# EAGLE schematic FPGA_ADC_USB_Board (EAGLE 6.5.0)
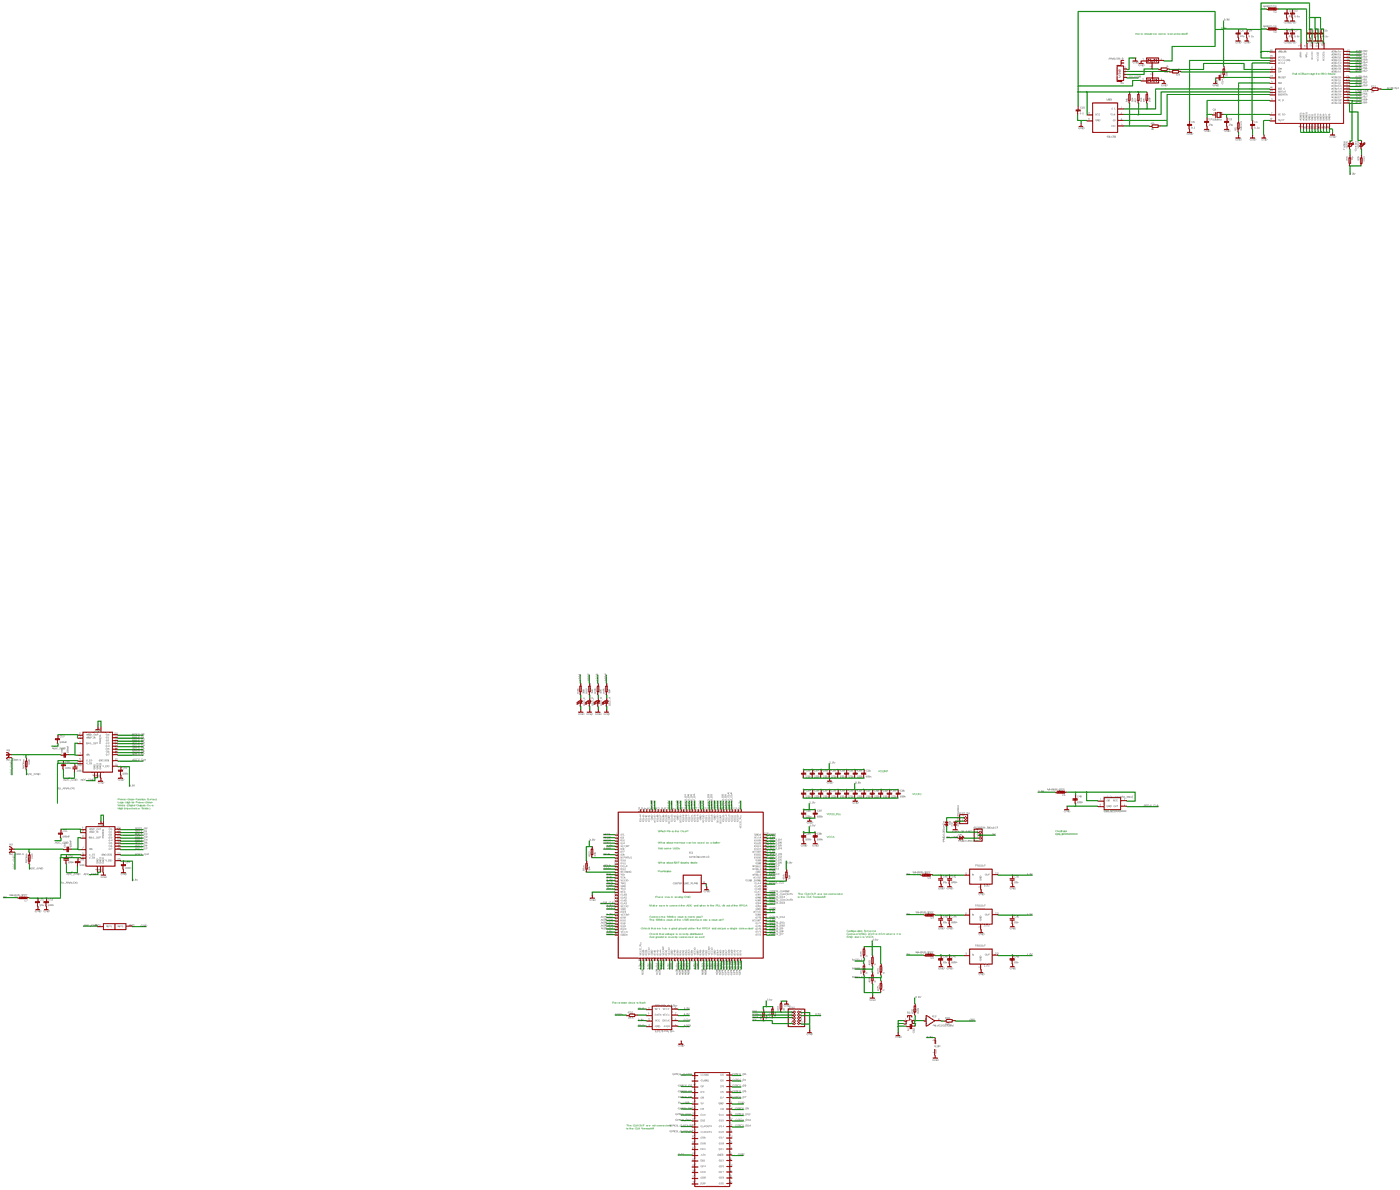
[diagram p0: schematic, sheet 1, overview]
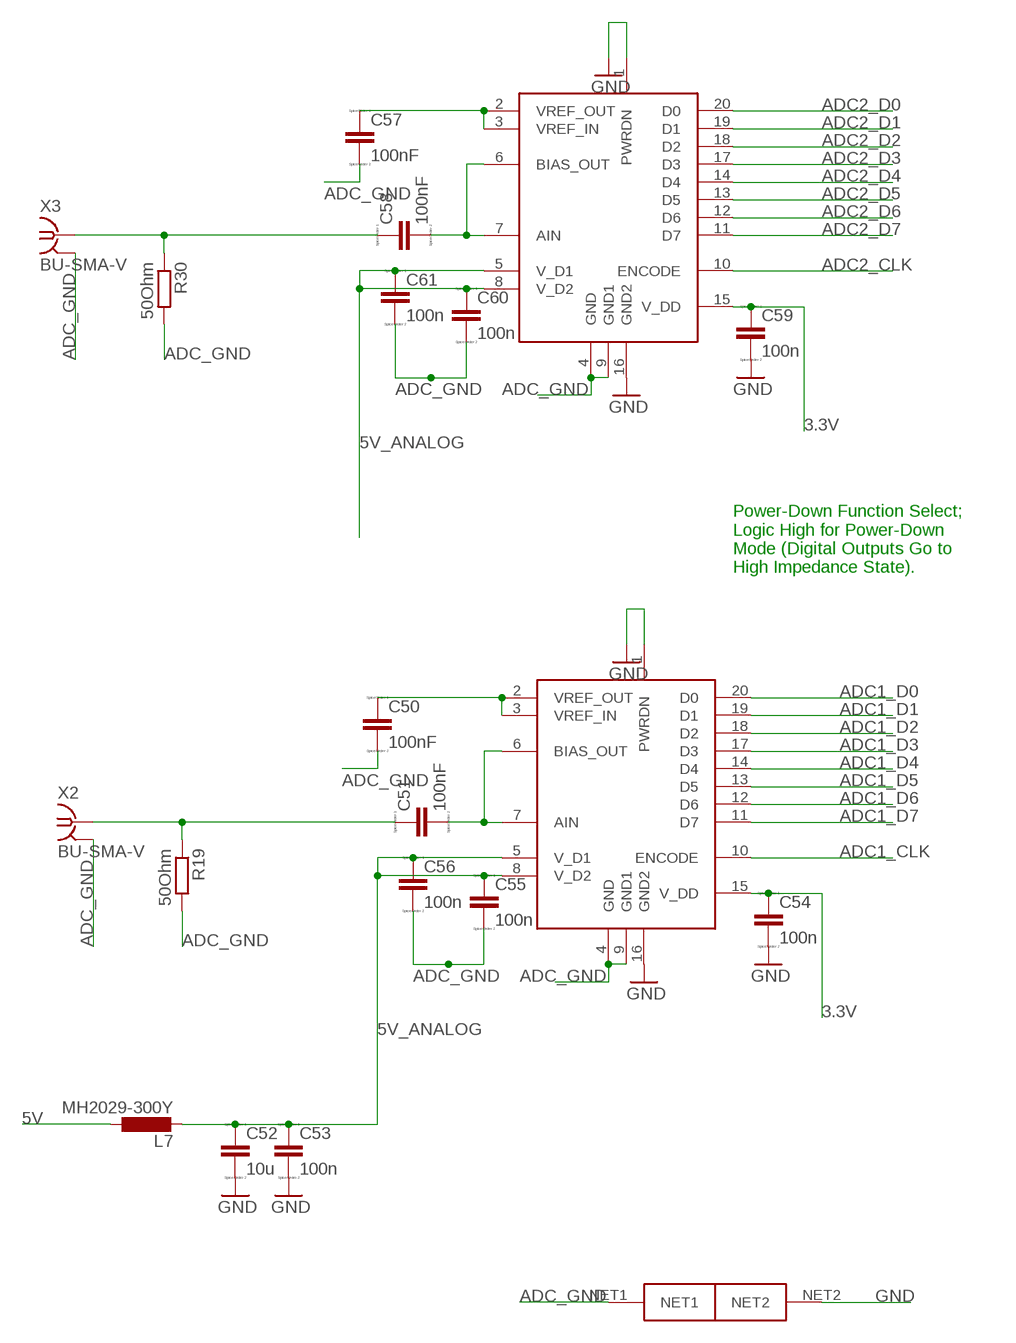
[diagram p1: schematic, sheet 1, part 1 of 4]
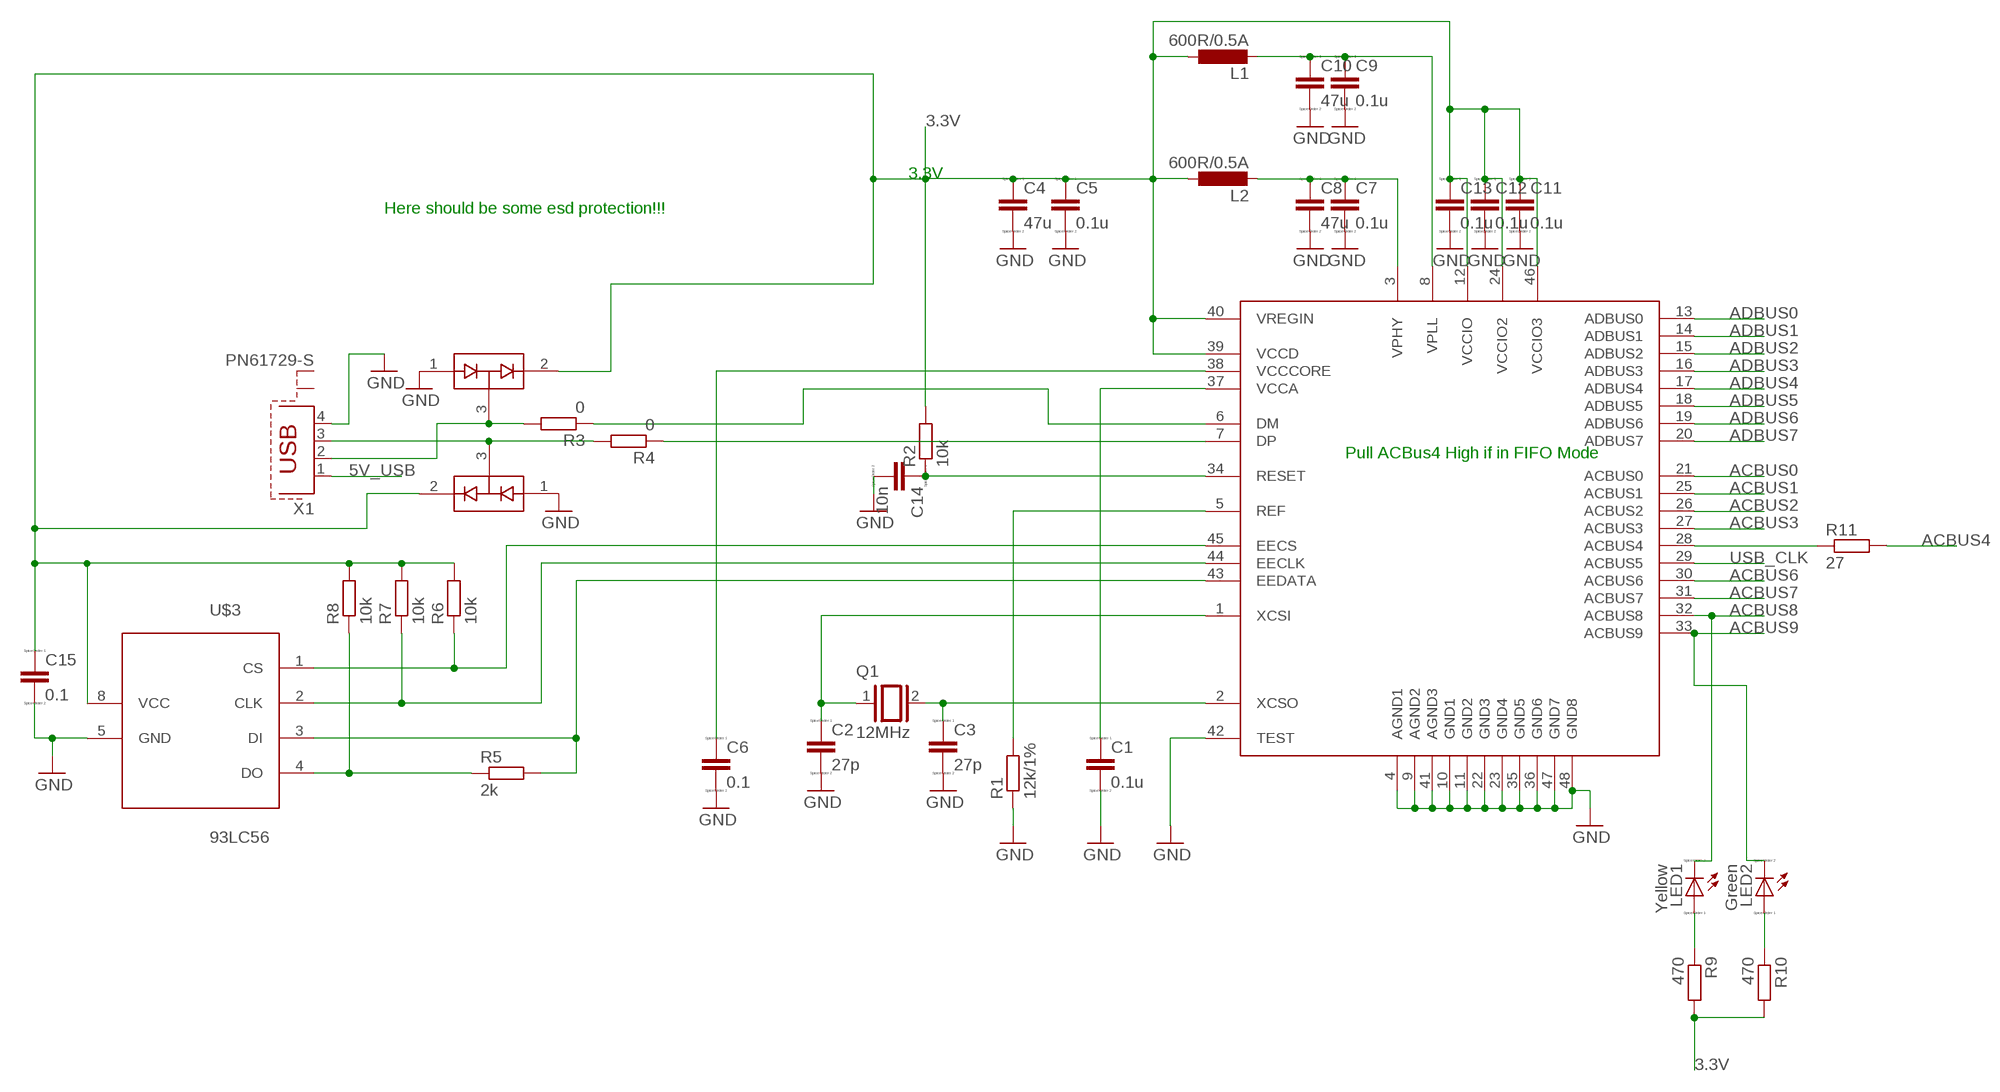
[diagram p2: schematic, sheet 1, part 2 of 4]
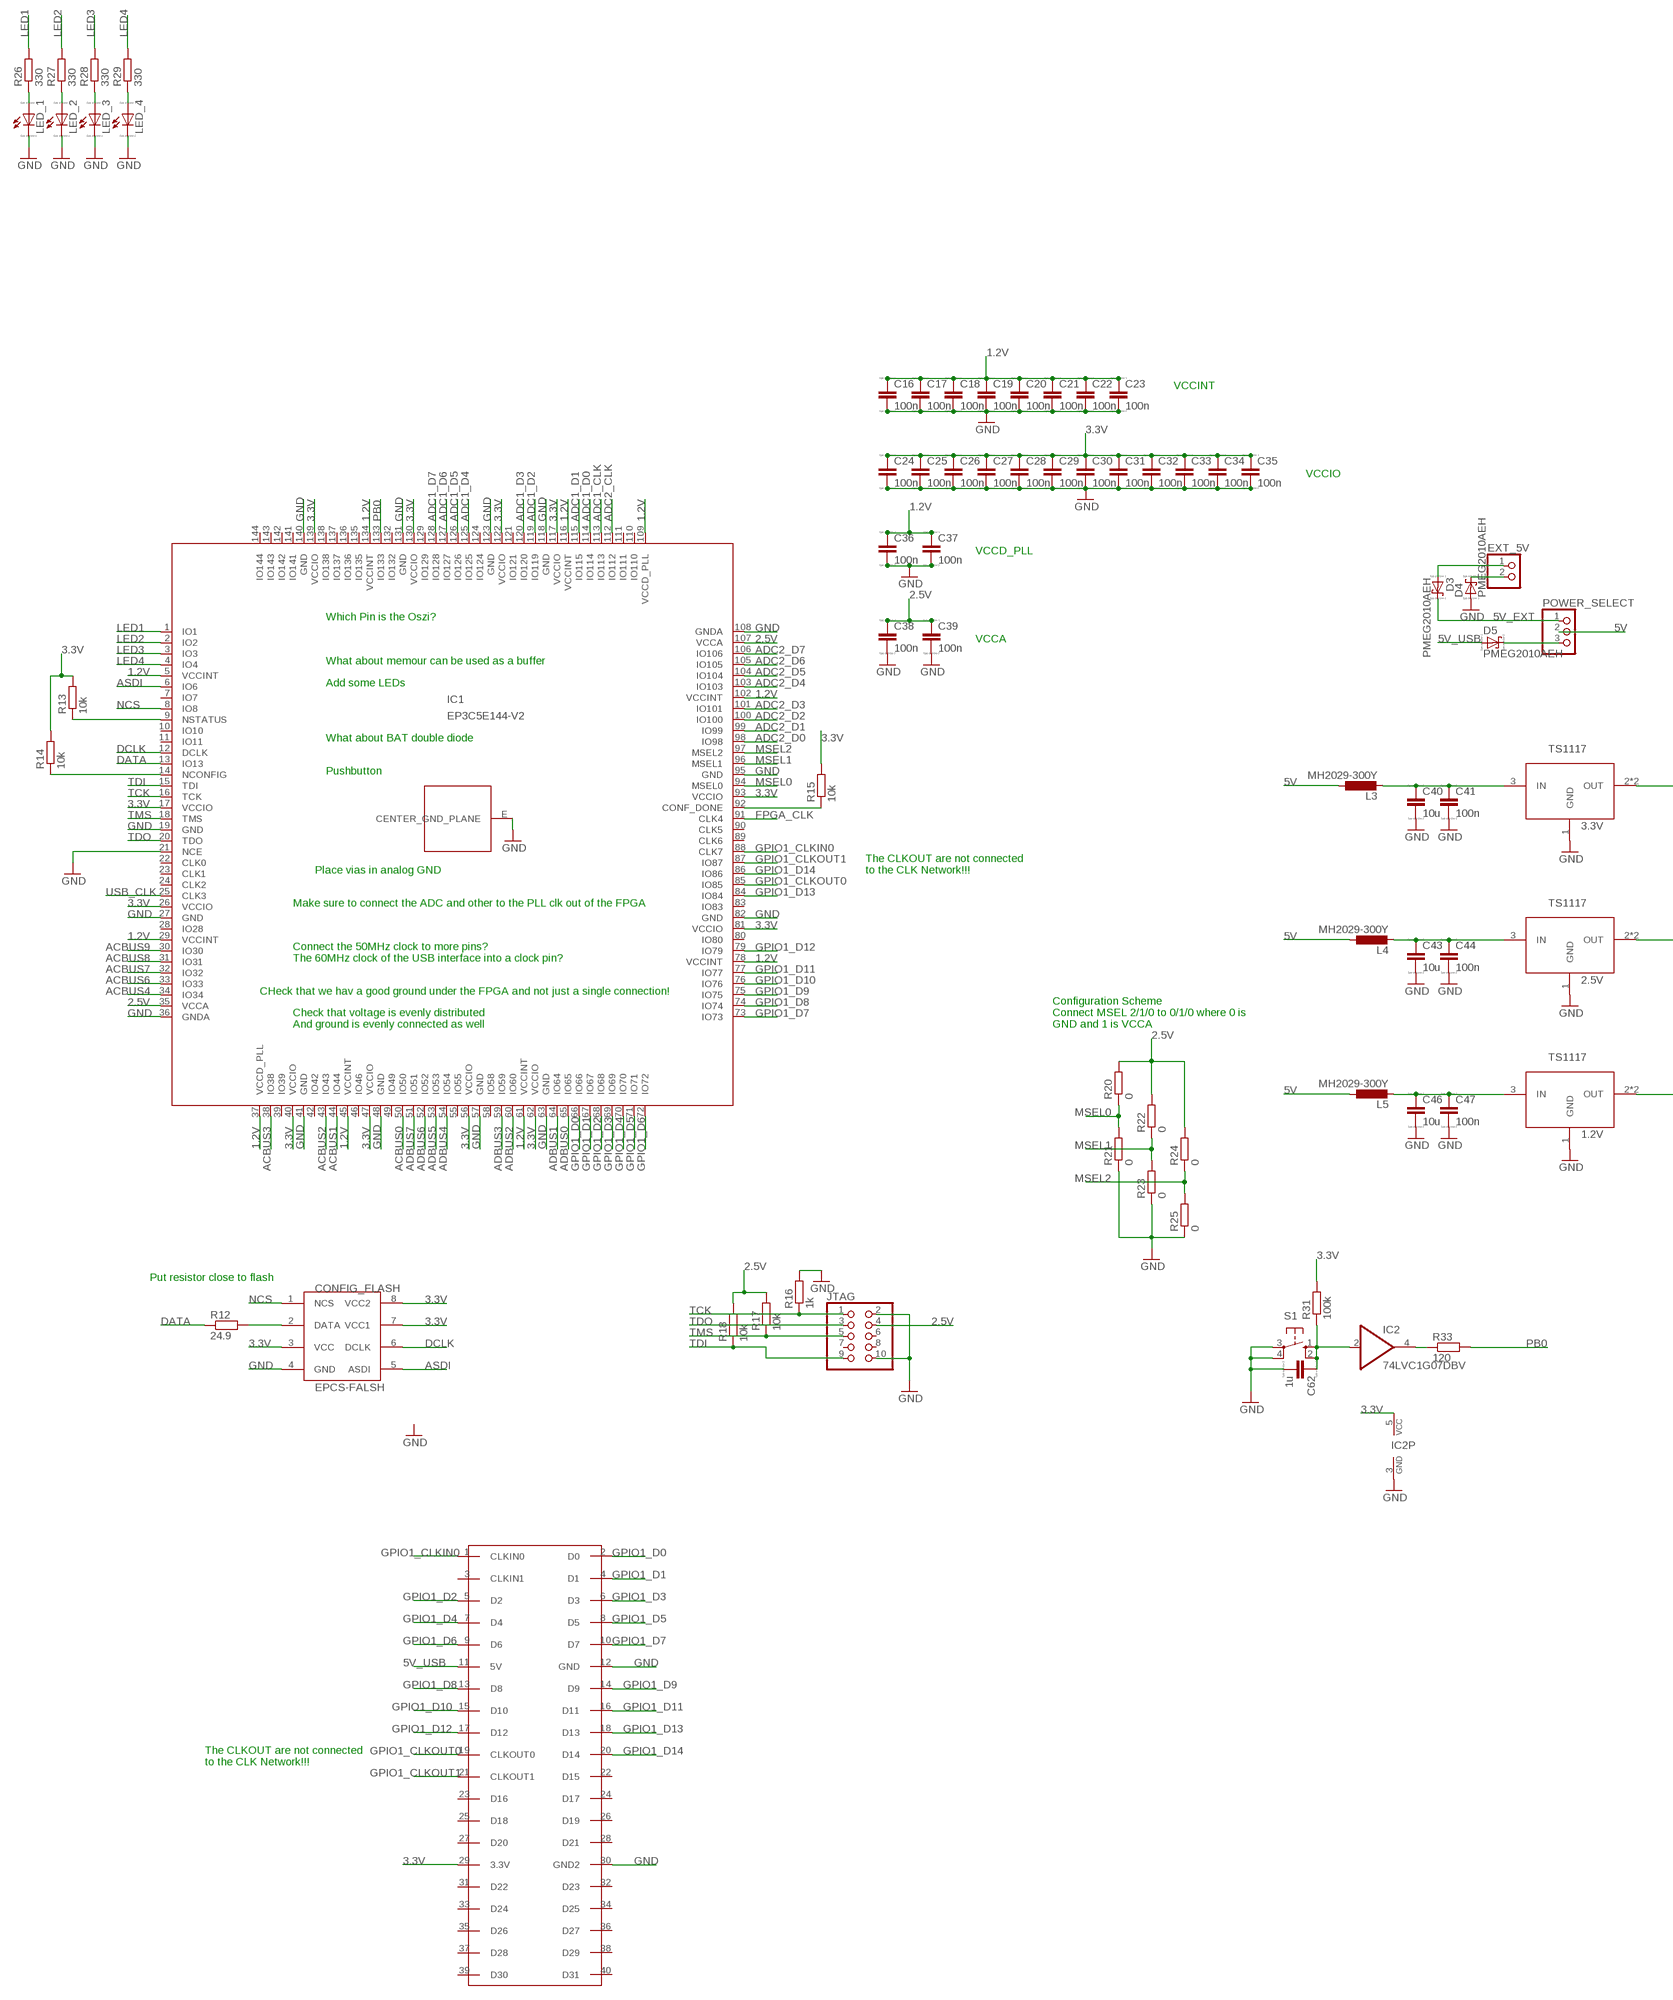
[diagram p3: schematic, sheet 1, part 3 of 4]
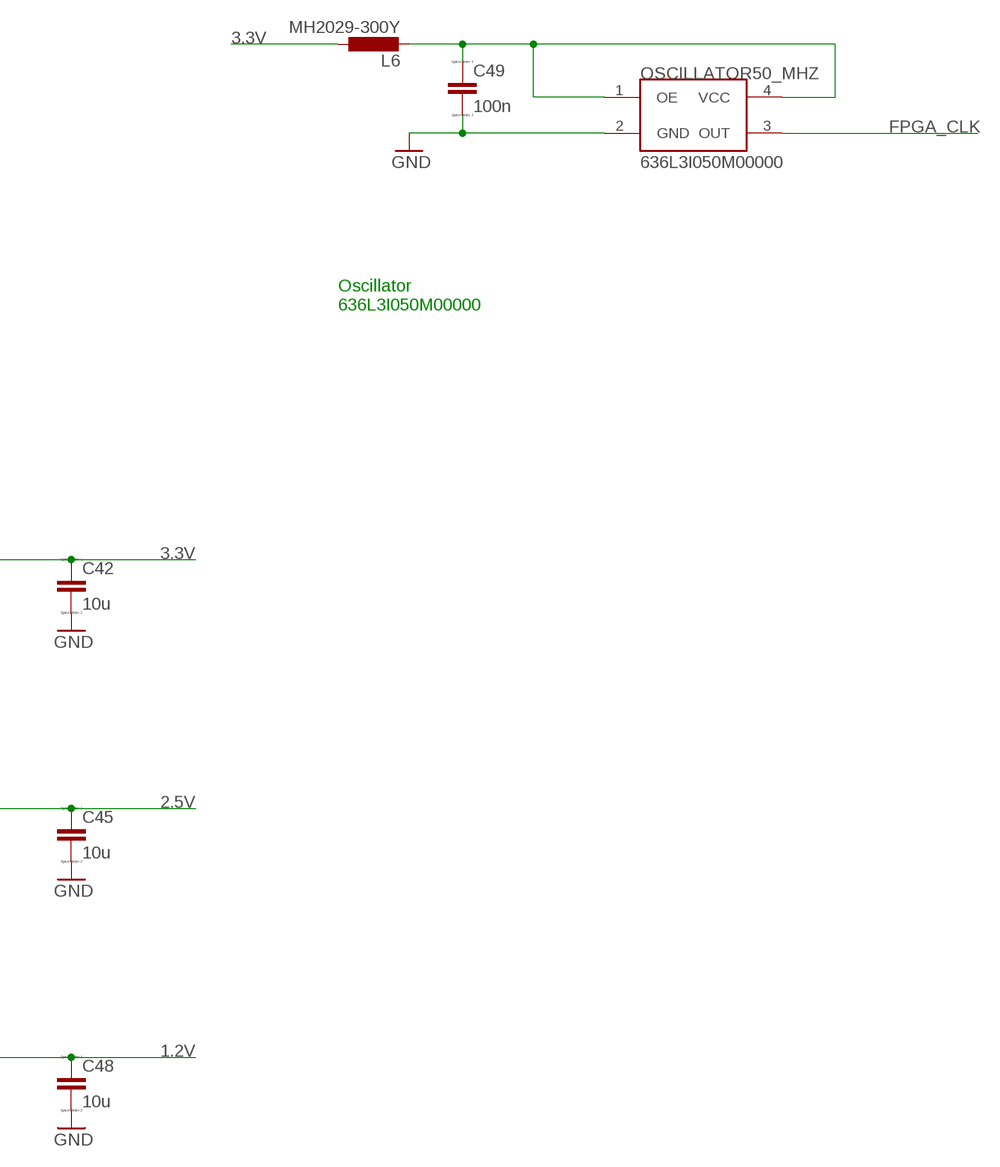
[diagram p4: schematic, sheet 1, part 4 of 4]

## Parts
C1  0.1u  C_SMD  [C0805]
C2  27p  C_SMD  [C0805]
C3  27p  C_SMD  [C0805]
C4  47u  C_SMD  [C0805]
C5  0.1u  C_SMD  [C0805]
C6  0.1  C_SMD  [C0805]
C7  0.1u  C_SMD  [C0805]
C8  47u  C_SMD  [C0805]
C9  0.1u  C_SMD  [C0805]
C10  47u  C_SMD  [C0805]
C11  0.1u  C_SMD  [C0805]
C12  0.1u  C_SMD  [C0805]
C13  0.1u  C_SMD  [C0805]
C14  10n  C_SMD  [C0805]
C15  0.1  C_SMD  [C0805]
C16  100n  C_SMD  [C0805]
C17  100n  C_SMD  [C0805]
C18  100n  C_SMD  [C0805]
C19  100n  C_SMD  [C0805]
C20  100n  C_SMD  [C0805]
C21  100n  C_SMD  [C0805]
C22  100n  C_SMD  [C0805]
C23  100n  C_SMD  [C0805]
C24  100n  C_SMD  [C0805]
C25  100n  C_SMD  [C0805]
C26  100n  C_SMD  [C0805]
C27  100n  C_SMD  [C0805]
C28  100n  C_SMD  [C0805]
C29  100n  C_SMD  [C0805]
C30  100n  C_SMD  [C0805]
C31  100n  C_SMD  [C0805]
C32  100n  C_SMD  [C0805]
C33  100n  C_SMD  [C0805]
C34  100n  C_SMD  [C0805]
C35  100n  C_SMD  [C0805]
C36  100n  C_SMD  [C0805]
C37  100n  C_SMD  [C0805]
C38  100n  C_SMD  [C0805]
C39  100n  C_SMD  [C0805]
C40  10u  C_SMD  [C0805]
C41  100n  C_SMD  [C0805]
C42  10u  C_SMD  [C0805]
C43  10u  C_SMD  [C0805]
C44  100n  C_SMD  [C0805]
C45  10u  C_SMD  [C0805]
C46  10u  C_SMD  [C0805]
C47  100n  C_SMD  [C0805]
C48  10u  C_SMD  [C0805]
C49  100n  C_SMD  [C0805]
C50  100nF  C_SMD  [C0805]
C51  100nF  C_SMD  [C0805]
C52  10u  C_SMD  [C0805]
C53  100n  C_SMD  [C0805]
C54  100n  C_SMD  [C0805]
C55  100n  C_SMD  [C0805]
C56  100n  C_SMD  [C0805]
C57  100nF  C_SMD  [C0805]
C58  100nF  C_SMD  [C0805]
C59  100n  C_SMD  [C0805]
C60  100n  C_SMD  [C0805]
C61  100n  C_SMD  [C0805]
C62  1u  C_SMD  [C0805]
CONFIG_FLASH  EPCS-FALSH  [SO08]
D1  BAV99  [SOT23]
D2  BAV99  [SOT23]
D3  PMEG2010AEH  [SOD123]
D4  PMEG2010AEH  [SOD123]
D5  PMEG2010AEH  [SOD123]
EXT_5V  PINHD-1X2  [1X02]
IC1  EP3C5E144-V2  [EQFP144]
IC2  74LVC1G07DBV  [SOT23-5]
JTAG  PINHD-2X5  [2X05]
L1  600R/0.5A  L_0805  [R0805]
L2  600R/0.5A  L_0805  [R0805]
L3  MH2029-300Y  L_0805  [R0805]
L4  MH2029-300Y  L_0805  [R0805]
L5  MH2029-300Y  L_0805  [R0805]
L6  MH2029-300Y  L_0805  [R0805]
L7  MH2029-300Y  L_0805  [R0805]
LED1  Yellow  LED_ELED_0805  [R0805]
LED2  Green  LED_ELED_0805  [R0805]
LED_1  LED_ELED_0805  [R0805]
LED_2  LED_ELED_0805  [R0805]
LED_3  LED_ELED_0805  [R0805]
LED_4  LED_ELED_0805  [R0805]
LS  3.3V  TS1117  [SOT223]
OSCILLATOR50_MHZ  636L3I050M00000  OSZI  [OSZI_5X3.2]
POWER_SELECT  PINHD-1X3  [1X03]
Q1  12MHz  XTAL/S  [QS]
R1  12k/1%  R-EU_M0805  [M0805]
R2  10k  R-EU_M0805  [M0805]
R3  0  R-EU_M0805  [M0805]
R4  0  R-EU_M0805  [M0805]
R5  2k  R-EU_M0805  [M0805]
R6  10k  R-EU_M0805  [M0805]
R7  10k  R-EU_M0805  [M0805]
R8  10k  R-EU_M0805  [M0805]
R9  470  R-EU_M0805  [M0805]
R10  470  R-EU_M0805  [M0805]
R11  27  R-EU_M0805  [M0805]
R12  24.9  R-EU_R0805  [R0805]
R13  10k  R-EU_R0805  [R0805]
R14  10k  R-EU_R0805  [R0805]
R15  10k  R-EU_R0805  [R0805]
R16  1k  R-EU_R0805  [R0805]
R17  10k  R-EU_R0805  [R0805]
R18  10k  R-EU_R0805  [R0805]
R19  50Ohm  R-EU_R0805  [R0805]
R20  0  R-EU_R0805  [R0805]
R21  0  R-EU_R0805  [R0805]
R22  0  R-EU_R0805  [R0805]
R23  0  R-EU_R0805  [R0805]
R24  0  R-EU_R0805  [R0805]
R25  0  R-EU_R0805  [R0805]
R26  330  R-EU_R0805  [R0805]
R27  330  R-EU_R0805  [R0805]
R28  330  R-EU_R0805  [R0805]
R29  330  R-EU_R0805  [R0805]
R30  50Ohm  R-EU_R0805  [R0805]
R31  100k  R-EU_R0805  [R0805]
R33  120  R-EU_R0805  [R0805]
S1  10-XX  [B3F-10XX]
U$1  FT232H  [LQFP48]
U$2  AD9057  [SSOP20]
U$3  93LC56  [DIL-08]
U$4  2.5V  TS1117  [SOT223]
U$5  1.2V  TS1117  [SOT223]
U$6  AD9057  [SSOP20]
U$7  FPGA_GPIO_DE0  [2X20]
U$8  NET_TIE  [NET-TIE]
X1  PN61729-S  [PN61729-S]
X2  BU-SMA-V  [BU-SMA-V]
X3  BU-SMA-V  [BU-SMA-V]

## Nets
1.2V: C16.1 C17.1 C18.1 C19.1 C20.1 C21.1 C22.1 C23.1 C36.1 C37.1 C48.1 IC1.5(VCCINT) IC1.29(VCCINT) IC1.37(VCCD_PLL) IC1.45(VCCINT) IC1.61(VCCINT) IC1.78(VCCINT) IC1.102(VCCINT) IC1.109(VCCD_PLL) IC1.116(VCCINT) IC1.134(VCCINT) U$5.2(OUT) U$5.4(OUT)
2.5V: C38.1 C39.1 C45.1 IC1.35(VCCA) IC1.107(VCCA) JTAG.4 R17.2 R18.2 R20.2 R22.2 R24.2 U$4.2(OUT) U$4.4(OUT)
3.3V: C4.1 C5.1 C11.1 C12.1 C13.1 C15.1 C24.1 C25.1 C26.1 C27.1 C28.1 C29.1 C30.1 C31.1 C32.1 C33.1 C34.1 C35.1 C42.1 C54.1 C59.1 CONFIG_FLASH.3(VCC) CONFIG_FLASH.7(VCC1) CONFIG_FLASH.8(VCC2) D1.2(C2) D2.2(C2) IC1.17(VCCIO) IC1.26(VCCIO) IC1.40(VCCIO) IC1.47(VCCIO) IC1.56(VCCIO) IC1.62(VCCIO) IC1.81(VCCIO) IC1.93(VCCIO) IC1.117(VCCIO) IC1.122(VCCIO) IC1.130(VCCIO) IC1.139(VCCIO) IC2.5(VCC) L1.1 L2.1 L6.1 LS.2(OUT) LS.4(OUT) R2.2 R6.2 R7.2 R8.2 R9.2 R10.2 R13.2 R14.2 R15.2 R31.2 U$1.12(VCCIO) U$1.24(VCCIO2) U$1.39(VCCD) U$1.40(VREGIN) U$1.46(VCCIO3) U$2.15(V_DD) U$3.8(VCC) U$6.15(V_DD) U$7.29(3.3V)
5V: L3.1 L4.1 L5.1 L7.1 POWER_SELECT.2
5V_ANALOG: C52.1 C53.1 C55.1 C56.1 C60.1 C61.1 L7.2 U$2.5(V_D1) U$2.8(V_D2) U$6.5(V_D1) U$6.8(V_D2)
5V_EXT: D3.1(A) POWER_SELECT.1
5V_USB: D5.2(C) U$7.11(5V) X1.1
ACBUS0: IC1.50(IO50) U$1.21(ACBUS0)
ACBUS1: IC1.44(IO44) U$1.25(ACBUS1)
ACBUS2: IC1.43(IO43) U$1.26(ACBUS2)
ACBUS3: IC1.38(IO38) U$1.27(ACBUS3)
ACBUS4: IC1.34(IO34) R11.2
ACBUS6: IC1.33(IO33) U$1.30(ACBUS6)
ACBUS7: IC1.32(IO32) U$1.31(ACBUS7)
ACBUS8: IC1.31(IO31) LED1.2(C) U$1.32(ACBUS8)
ACBUS9: IC1.30(IO30) LED2.2(C) U$1.33(ACBUS9)
ADBUS0: IC1.65(IO65) U$1.13(ADBUS0)
ADBUS1: IC1.64(IO64) U$1.14(ADBUS1)
ADBUS2: IC1.60(IO60) U$1.15(ADBUS2)
ADBUS3: IC1.59(IO59) U$1.16(ADBUS3)
ADBUS4: IC1.54(IO54) U$1.17(ADBUS4)
ADBUS5: IC1.53(IO53) U$1.18(ADBUS5)
ADBUS6: IC1.52(IO52) U$1.19(ADBUS6)
ADBUS7: IC1.51(IO51) U$1.20(ADBUS7)
ADC1_CLK: IC1.113(IO113) U$6.10(ENCODE)
ADC1_D0: IC1.114(IO114) U$6.20(D0)
ADC1_D1: IC1.115(IO115) U$6.19(D1)
ADC1_D2: IC1.119(IO119) U$6.18(D2)
ADC1_D3: IC1.120(IO120) U$6.17(D3)
ADC1_D4: IC1.125(IO125) U$6.14(D4)
ADC1_D5: IC1.126(IO126) U$6.13(D5)
ADC1_D6: IC1.127(IO127) U$6.12(D6)
ADC1_D7: IC1.128(IO128) U$6.11(D7)
ADC2_CLK: IC1.112(IO112) U$2.10(ENCODE)
ADC2_D0: IC1.98(IO98) U$2.20(D0)
ADC2_D1: IC1.99(IO99) U$2.19(D1)
ADC2_D2: IC1.100(IO100) U$2.18(D2)
ADC2_D3: IC1.101(IO101) U$2.17(D3)
ADC2_D4: IC1.103(IO103) U$2.14(D4)
ADC2_D5: IC1.104(IO104) U$2.13(D5)
ADC2_D6: IC1.105(IO105) U$2.12(D6)
ADC2_D7: IC1.106(IO106) U$2.11(D7)
ADC_GND: C50.2 C55.2 C56.2 C57.2 C60.2 C61.2 R19.2 R30.2 U$2.4(GND) U$2.9(GND1) U$6.4(GND) U$6.9(GND1) U$8.NET1 X2.2 X2.3 X2.4 X2.5 X3.2 X3.3 X3.4 X3.5
ASDI: CONFIG_FLASH.5(ASDI) IC1.6(IO6)
DATA: IC1.13(IO13) R12.1
DCLK: CONFIG_FLASH.6(DCLK) IC1.12(DCLK)
FPGA_CLK: IC1.91(CLK4) OSCILLATOR50_MHZ.3(OUT)
GND: C1.2 C2.2 C3.2 C4.2 C5.2 C6.2 C7.2 C8.2 C9.2 C10.2 C11.2 C12.2 C13.2 C14.2 C15.2 C16.2 C17.2 C18.2 C19.2 C20.2 C21.2 C22.2 C23.2 C24.2 C25.2 C26.2 C27.2 C28.2 C29.2 C30.2 C31.2 C32.2 C33.2 C34.2 C35.2 C36.2 C37.2 C38.2 C39.2 C40.2 C41.2 C42.2 C43.2 C44.2 C45.2 C46.2 C47.2 C48.2 C49.2 C52.2 C53.2 C54.2 C59.2 C62.2 CONFIG_FLASH.4(GND) D1.1(A1) D2.1(A1) D4.2(C) IC1.19(GND) IC1.21(NCE) IC1.27(GND) IC1.36(GNDA) IC1.41(GND) IC1.48(GND) IC1.57(GND) IC1.63(GND) IC1.82(GND) IC1.95(GND) IC1.108(GNDA) IC1.118(GND) IC1.123(GND) IC1.131(GND) IC1.140(GND) IC1.E(CENTER_GND_PLANE) IC2.3(GND) JTAG.2 JTAG.10 LED_1.2(C) LED_2.2(C) LED_3.2(C) LED_4.2(C) LS.1(GND) OSCILLATOR50_MHZ.2(GND) R1.1 R16.2 R21.1 R23.1 R25.1 S1.3(P) S1.4(P1) U$1.4(AGND1) U$1.9(AGND2) U$1.10(GND1) U$1.11(GND2) U$1.22(GND3) U$1.23(GND4) U$1.35(GND5) U$1.36(GND6) U$1.41(AGND3) U$1.42(TEST) U$1.47(GND7) U$1.48(GND8) U$2.1(PWRDN) U$2.16(GND2) U$3.5(GND) U$4.1(GND) U$5.1(GND) U$6.1(PWRDN) U$6.16(GND2) U$7.12(GND) U$7.30(GND2) U$8.NET2 X1.4
GPIO1_CLKIN0: IC1.88(CLK7) U$7.1(CLKIN0)
GPIO1_CLKOUT0: IC1.85(IO85) U$7.19(CLKOUT0)
GPIO1_CLKOUT1: IC1.87(IO87) U$7.21(CLKOUT1)
GPIO1_D0: IC1.66(IO66) U$7.2(D0)
GPIO1_D1: IC1.67(IO67) U$7.4(D1)
GPIO1_D2: IC1.68(IO68) U$7.5(D2)
GPIO1_D3: IC1.69(IO69) U$7.6(D3)
GPIO1_D4: IC1.70(IO70) U$7.7(D4)
GPIO1_D5: IC1.71(IO71) U$7.8(D5)
GPIO1_D6: IC1.72(IO72) U$7.9(D6)
GPIO1_D7: IC1.73(IO73) U$7.10(D7)
GPIO1_D8: IC1.74(IO74) U$7.13(D8)
GPIO1_D9: IC1.75(IO75) U$7.14(D9)
GPIO1_D10: IC1.76(IO76) U$7.15(D10)
GPIO1_D11: IC1.77(IO77) U$7.16(D11)
GPIO1_D12: IC1.79(IO79) U$7.17(D12)
GPIO1_D13: IC1.84(IO84) U$7.18(D13)
GPIO1_D14: IC1.86(IO86) U$7.20(D14)
LED1: IC1.1(IO1) R26.2
LED2: IC1.2(IO2) R27.2
LED3: IC1.3(IO3) R28.2
LED4: IC1.4(IO4) R29.2
MSEL0: IC1.94(MSEL0) R20.1 R21.2
MSEL1: IC1.96(MSEL1) R22.1 R23.2
MSEL2: IC1.97(MSEL2) R24.1 R25.2
N$1: C9.1 C10.1 L1.2 U$1.8(VPLL)
N$2: CONFIG_FLASH.2(DATA) R12.2
N$3: C1.1 U$1.37(VCCA)
N$4: R1.2 U$1.5(REF)
N$5: C6.1 U$1.38(VCCCORE)
N$6: C2.1 Q1.1 U$1.1(XCSI)
N$7: C3.1 Q1.2 U$1.2(XCSO)
N$8: C14.1 R2.1 U$1.34(RESET)
N$9: R4.1 U$1.7(DP)
N$10: IC1.9(NSTATUS) R13.1
N$11: D1.3(COM) R3.2 X1.2
N$12: R3.1 U$1.6(DM)
N$13: C7.1 C8.1 L2.2 U$1.3(VPHY)
N$14: D2.3(COM) R4.2 X1.3
N$15: IC1.14(NCONFIG) R14.1
N$16: IC1.92(CONF_DONE) R15.1
N$17: C40.1 C41.1 L3.2 LS.3(IN)
N$18: C43.1 C44.1 L4.2 U$4.3(IN)
N$19: C46.1 C47.1 L5.2 U$5.3(IN)
N$20: D3.2(C) EXT_5V.1
N$21: D4.1(A) EXT_5V.2
N$22: D5.1(A) POWER_SELECT.3
N$23: C49.1 L6.2 OSCILLATOR50_MHZ.1(OE) OSCILLATOR50_MHZ.4(VCC)
N$24: C51.2 U$6.6(BIAS_OUT) U$6.7(AIN)
N$25: C50.1 U$6.2(VREF_OUT) U$6.3(VREF_IN)
N$26: C51.1 R19.1 X2.1
N$27: C58.2 U$2.6(BIAS_OUT) U$2.7(AIN)
N$28: R6.1 U$1.45(EECS) U$3.1(CS)
N$29: R7.1 U$1.44(EECLK) U$3.2(CLK)
N$30: R5.2 U$1.43(EEDATA) U$3.3(DI)
N$31: R5.1 R8.1 U$3.4(DO)
N$32: C57.1 U$2.2(VREF_OUT) U$2.3(VREF_IN)
N$33: C58.1 R30.1 X3.1
N$34: LED_1.1(A) R26.1
N$37: LED_2.1(A) R27.1
N$38: LED1.1(A) R9.1
N$39: LED2.1(A) R10.1
N$40: LED_3.1(A) R28.1
N$41: R11.1 U$1.28(ACBUS4)
N$42: LED_4.1(A) R29.1
N$44: IC2.4(O) R33.1
N$49: C62.1 IC2.2(I) R31.1 S1.1(S) S1.2(S1)
NCS: CONFIG_FLASH.1(NCS) IC1.8(IO8)
PB0: IC1.133(IO133) R33.2
TCK: IC1.16(TCK) JTAG.1 R16.1
TDI: IC1.15(TDI) JTAG.9 R18.1
TDO: IC1.20(TDO) JTAG.3
TMS: IC1.18(TMS) JTAG.5 R17.1
USB_CLK: IC1.25(CLK3) U$1.29(ACBUS5)
Unconnected: IC1.7(IO7) IC1.10(IO10) IC1.11(IO11) IC1.22(CLK0) IC1.23(CLK1) IC1.24(CLK2) IC1.28(IO28) IC1.39(IO39) IC1.42(IO42) IC1.46(IO46) IC1.49(IO49) IC1.55(IO55) IC1.58(IO58) IC1.80(IO80) IC1.83(IO83) IC1.89(CLK6) IC1.90(CLK5) IC1.110(IO110) IC1.111(IO111) IC1.121(IO121) IC1.124(IO124) IC1.129(IO129) IC1.132(IO132) IC1.135(IO135) IC1.136(IO136) IC1.137(IO137) IC1.138(IO138) IC1.141(IO141) IC1.142(IO142) IC1.143(IO143) IC1.144(IO144) JTAG.6 JTAG.7 JTAG.8 U$7.3(CLKIN1) U$7.22(D15) U$7.23(D16) U$7.24(D17) U$7.25(D18) U$7.26(D19) U$7.27(D20) U$7.28(D21) U$7.31(D22) U$7.32(D23) U$7.33(D24) U$7.34(D25) U$7.35(D26) U$7.36(D27) U$7.37(D28) U$7.38(D29) U$7.39(D30) U$7.40(D31) X1.S1 X1.S2

## Notes on the sheet
- 3.3V
- Here should be some esd protection!!!
- Pull ACBus4 High if in FIFO Mode
- VCCINT
- VCCIO
- Power-Down Function Select;
  Logic High for Power-Down
  Mode (Digital Outputs Go to
  High Impedance State).
- VCCD_PLL
- Which Pin is the Oszi?
- Oscillator
  636L3I050M00000
- VCCA
- What about memour can be used as a buffer
- Add some LEDs
- What about BAT double diode
- Pushbutton
- Place vias in analog GND
- The CLKOUT are not connected 
  to the CLK Network!!!
- Make sure to connect the ADC and other to the PLL clk out of the FPGA
- Connect the 50MHz clock to more pins?
  The 60MHz clock of the USB interface into a clock pin?
- CHeck that we hav a good ground under the FPGA and not just a single connection!
- Check that voltage is evenly distributed
  And ground is evenly connected as well
- Configuration Scheme
  Connect MSEL 2/1/0 to 0/1/0 where 0 is
  GND and 1 is VCCA
- Put resistor close to flash
- The CLKOUT are not connected 
  to the CLK Network!!!

## Library data of the parts
C1-C62 = 0myLib:C_SMD: CAPACITOR, European symbol; SPICEMODEL: NONE; SPICEPREFIX: C
CONFIG_FLASH = 0myLib:EPCS-FALSH
D1 D2 = 0myLib:BAV99: Two small signal silicon diodes connected anode to cathode. Connections to all three nodes available. DIO-10647; PROD_ID: DIO-10647
D3-D5 = 0myLib:PMEG2010AEH
EXT_5V = 0myLib:PINHD-1X2: PIN HEADER
IC1 = 0myLib:EP3C5E144-V2: EP3C5E144 edit this description Auto generated by make-symbol-device-package-bsdl.ulp Rev. 43 Source: EP3C5E144.BSD
IC2 = 0myLib:74*1G07: Single Buffer/Driver With Open-Drain Output
JTAG = 0myLib:PINHD-2X5: PIN HEADER
L1-L7 = 0myLib:L_0805
LED1 LED2 LED_1-LED_4 = 0myLib:LED_E: LED Source: http://www.osram.convergy.de Source: www.luxeon.com Source: www.kingbright.com
LS U$4 U$5 = 0myLib:TS1117
OSCILLATOR50_MHZ = 0myLib:OSZI
POWER_SELECT = 0myLib:PINHD-1X3: PIN HEADER
Q1 = 0myLib:XTAL/S: CRYSTAL
R1-R31 R33 = 0myLib:R-EU_: RESISTOR, European symbol
S1 = 0myLib:10-XX: OMRON SWITCH; MPN: B3F-1000; OC_FARNELL: 176432; OC_NEWARK: 36M3542
U$1 = 0myLib:FT232H
U$2 U$6 = 0myLib:AD9057: 8-Bit 40 MSPS/60 MSPS/80 MSPS A/D Converter
U$3 = 0myLib:93LC56
U$7 = 0myLib:FPGA_GPIO_DE0
U$8 = 0myLib:NET_TIE
X1 = 0myLib:PN61729-S: BERG USB connector; OC_FARNELL: unknown; OC_NEWARK: unknown
X2 X3 = 0myLib:BU-SMA-V: FEMALE SMA CONNECTOR Radiall distributor RS 112-3794; OC_FARNELL: unknown; OC_NEWARK: unknown